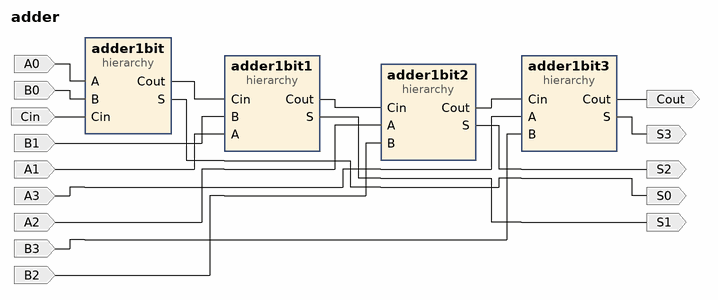
[diagram p0: block diagram of the top level]
# Vivado block design adder, xc7a35tcpg236-1, Vivado 2018.2.1
create_bd_design adder

create_bd_port -dir O -type data S0
create_bd_port -dir I -type data A0
create_bd_port -dir I -type data B0
create_bd_port -dir I -type data Cin
create_bd_port -dir I -type data B1
create_bd_port -dir O -type data Cout
create_bd_port -dir O -type data S3
create_bd_port -dir I -type data A3
create_bd_port -dir O -type data S2
create_bd_port -dir O -type data S1
create_bd_port -dir I -type data A2
create_bd_port -dir I -type data B3
create_bd_port -dir I -type data A1
create_bd_port -dir I -type data B2

create_bd_cell -type hier adder1bit
create_bd_cell -type hier adder1bit1
create_bd_cell -type hier adder1bit2
create_bd_cell -type hier adder1bit3

# ---- hierarchy /adder1bit ----
current_bd_instance /adder1bit
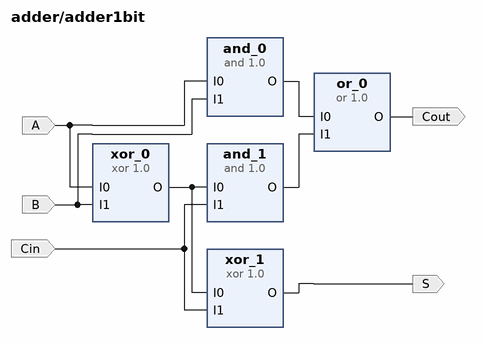
[diagram p1: block diagram inside /adder1bit]
create_bd_pin -dir I -type data A
create_bd_pin -dir I -type data B
create_bd_pin -dir I -type data Cin
create_bd_pin -dir O -type data S
create_bd_pin -dir O -type data Cout

create_bd_cell -type ip -vlnv FIT:user:and:1.0 and_0
create_bd_cell -type ip -vlnv FIT:user:xor:1.0 xor_0
create_bd_cell -type ip -vlnv FIT:user:and:1.0 and_1
create_bd_cell -type ip -vlnv FIT:user:xor:1.0 xor_1
create_bd_cell -type ip -vlnv FIT:user:or:1.0 or_0

# ---- hierarchy /adder1bit1 ----
current_bd_instance /adder1bit1
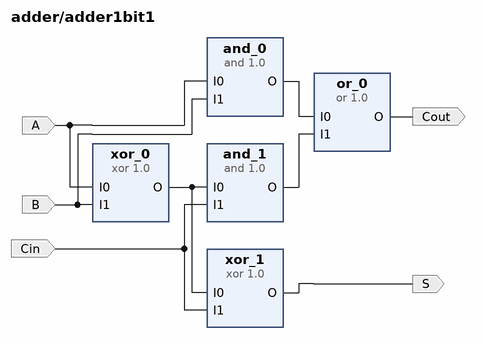
[diagram p2: block diagram inside /adder1bit1]
create_bd_pin -dir I -type data A
create_bd_pin -dir I -type data B
create_bd_pin -dir I -type data Cin
create_bd_pin -dir O -type data S
create_bd_pin -dir O -type data Cout

create_bd_cell -type ip -vlnv FIT:user:and:1.0 and_0
create_bd_cell -type ip -vlnv FIT:user:xor:1.0 xor_0
create_bd_cell -type ip -vlnv FIT:user:and:1.0 and_1
create_bd_cell -type ip -vlnv FIT:user:xor:1.0 xor_1
create_bd_cell -type ip -vlnv FIT:user:or:1.0 or_0

# ---- hierarchy /adder1bit2 ----
current_bd_instance /adder1bit2
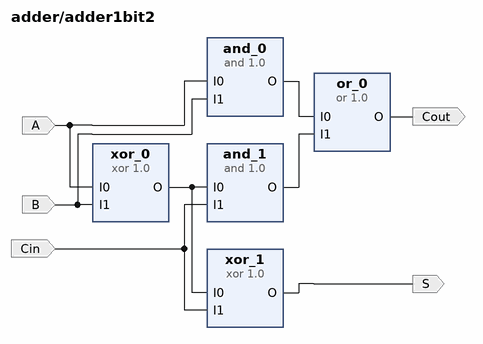
[diagram p3: block diagram inside /adder1bit2]
create_bd_pin -dir I -type data A
create_bd_pin -dir I -type data B
create_bd_pin -dir I -type data Cin
create_bd_pin -dir O -type data S
create_bd_pin -dir O -type data Cout

create_bd_cell -type ip -vlnv FIT:user:and:1.0 and_0
create_bd_cell -type ip -vlnv FIT:user:xor:1.0 xor_0
create_bd_cell -type ip -vlnv FIT:user:and:1.0 and_1
create_bd_cell -type ip -vlnv FIT:user:xor:1.0 xor_1
create_bd_cell -type ip -vlnv FIT:user:or:1.0 or_0

# ---- hierarchy /adder1bit3 ----
current_bd_instance /adder1bit3
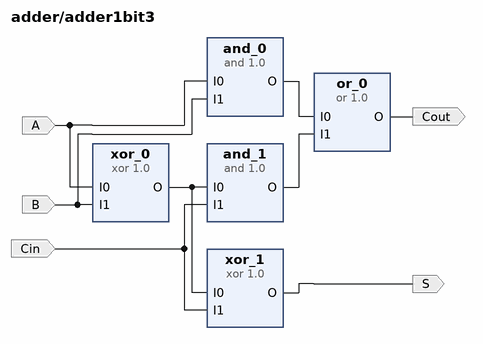
[diagram p4: block diagram inside /adder1bit3]
create_bd_pin -dir I -type data A
create_bd_pin -dir I -type data B
create_bd_pin -dir I -type data Cin
create_bd_pin -dir O -type data S
create_bd_pin -dir O -type data Cout

create_bd_cell -type ip -vlnv FIT:user:and:1.0 and_0
create_bd_cell -type ip -vlnv FIT:user:xor:1.0 xor_0
create_bd_cell -type ip -vlnv FIT:user:and:1.0 and_1
create_bd_cell -type ip -vlnv FIT:user:xor:1.0 xor_1
create_bd_cell -type ip -vlnv FIT:user:or:1.0 or_0

# ---- connections ----

current_bd_instance /adder1bit
connect_bd_net [get_bd_pins and_0/O] [get_bd_pins or_0/I0]
connect_bd_net [get_bd_pins xor_0/O] [get_bd_pins xor_1/I0] [get_bd_pins and_1/I0]
connect_bd_net [get_bd_pins and_1/O] [get_bd_pins or_0/I1]
connect_bd_net -net I0_0_1 [get_bd_pins A] [get_bd_pins xor_0/I0] [get_bd_pins and_0/I0]
connect_bd_net -net I1_0_1 [get_bd_pins B] [get_bd_pins xor_0/I1] [get_bd_pins and_0/I1]
connect_bd_net -net I1_0_2 [get_bd_pins Cin] [get_bd_pins xor_1/I1] [get_bd_pins and_1/I1]
connect_bd_net [get_bd_pins xor_1/O] [get_bd_pins S]
connect_bd_net [get_bd_pins or_0/O] [get_bd_pins Cout]

current_bd_instance /adder1bit1
connect_bd_net [get_bd_pins and_0/O] [get_bd_pins or_0/I0]
connect_bd_net [get_bd_pins xor_0/O] [get_bd_pins xor_1/I0] [get_bd_pins and_1/I0]
connect_bd_net [get_bd_pins and_1/O] [get_bd_pins or_0/I1]
connect_bd_net -net I0_0_1 [get_bd_pins A] [get_bd_pins xor_0/I0] [get_bd_pins and_0/I0]
connect_bd_net -net I1_0_1 [get_bd_pins B] [get_bd_pins xor_0/I1] [get_bd_pins and_0/I1]
connect_bd_net -net I1_0_2 [get_bd_pins Cin] [get_bd_pins xor_1/I1] [get_bd_pins and_1/I1]
connect_bd_net [get_bd_pins xor_1/O] [get_bd_pins S]
connect_bd_net [get_bd_pins or_0/O] [get_bd_pins Cout]

current_bd_instance /adder1bit2
connect_bd_net [get_bd_pins and_0/O] [get_bd_pins or_0/I0]
connect_bd_net [get_bd_pins xor_0/O] [get_bd_pins xor_1/I0] [get_bd_pins and_1/I0]
connect_bd_net [get_bd_pins and_1/O] [get_bd_pins or_0/I1]
connect_bd_net -net I0_0_1 [get_bd_pins A] [get_bd_pins xor_0/I0] [get_bd_pins and_0/I0]
connect_bd_net -net I1_0_1 [get_bd_pins B] [get_bd_pins xor_0/I1] [get_bd_pins and_0/I1]
connect_bd_net -net I1_0_2 [get_bd_pins Cin] [get_bd_pins xor_1/I1] [get_bd_pins and_1/I1]
connect_bd_net [get_bd_pins xor_1/O] [get_bd_pins S]
connect_bd_net [get_bd_pins or_0/O] [get_bd_pins Cout]

current_bd_instance /adder1bit3
connect_bd_net [get_bd_pins and_0/O] [get_bd_pins or_0/I0]
connect_bd_net [get_bd_pins xor_0/O] [get_bd_pins xor_1/I0] [get_bd_pins and_1/I0]
connect_bd_net [get_bd_pins and_1/O] [get_bd_pins or_0/I1]
connect_bd_net -net I0_0_1 [get_bd_pins A] [get_bd_pins xor_0/I0] [get_bd_pins and_0/I0]
connect_bd_net -net I1_0_1 [get_bd_pins B] [get_bd_pins xor_0/I1] [get_bd_pins and_0/I1]
connect_bd_net -net I1_0_2 [get_bd_pins Cin] [get_bd_pins xor_1/I1] [get_bd_pins and_1/I1]
connect_bd_net [get_bd_pins xor_1/O] [get_bd_pins S]
connect_bd_net [get_bd_pins or_0/O] [get_bd_pins Cout]

current_bd_instance /
connect_bd_net -net xor_1_O [get_bd_pins adder1bit/S] [get_bd_ports S0]
connect_bd_net -net or_0_O [get_bd_pins adder1bit/Cout] [get_bd_pins adder1bit1/Cin]
connect_bd_net -net I0_0_1 [get_bd_ports A0] [get_bd_pins adder1bit/A]
connect_bd_net -net I1_0_1 [get_bd_ports B0] [get_bd_pins adder1bit/B]
connect_bd_net -net I1_0_2 [get_bd_ports Cin] [get_bd_pins adder1bit/Cin]
connect_bd_net [get_bd_pins adder1bit1/Cout] [get_bd_pins adder1bit2/Cin]
connect_bd_net [get_bd_pins adder1bit2/Cout] [get_bd_pins adder1bit3/Cin]
connect_bd_net -net B_0_1 [get_bd_ports B1] [get_bd_pins adder1bit1/B]
connect_bd_net [get_bd_pins adder1bit3/Cout] [get_bd_ports Cout]
connect_bd_net [get_bd_pins adder1bit3/S] [get_bd_ports S3]
connect_bd_net -net A_0_1 [get_bd_ports A3] [get_bd_pins adder1bit3/A]
connect_bd_net [get_bd_pins adder1bit2/S] [get_bd_ports S2]
connect_bd_net [get_bd_pins adder1bit1/S] [get_bd_ports S1]
connect_bd_net -net A_1_1 [get_bd_ports A2] [get_bd_pins adder1bit2/A]
connect_bd_net -net B_1_1 [get_bd_ports B3] [get_bd_pins adder1bit3/B]
connect_bd_net -net A_2_1 [get_bd_ports A1] [get_bd_pins adder1bit1/A]
connect_bd_net -net B_2_1 [get_bd_ports B2] [get_bd_pins adder1bit2/B]

validate_bd_design
save_bd_design
